# EAGLE design photoresistor-array (EAGLE 8.3.1)
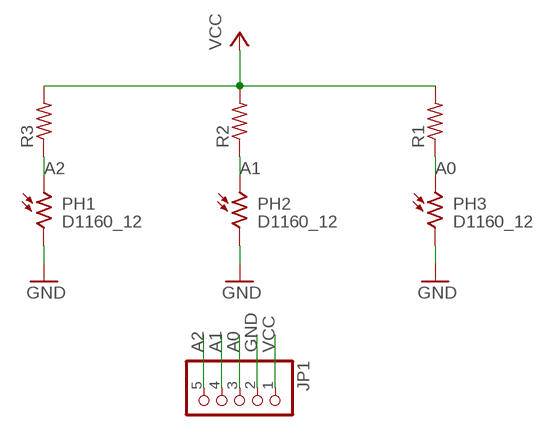
[diagram p0: schematic, sheet 1]

## Parts
JP1  PINHD-1X5  [1X05]
PH1  D1160_12  [D11XX]
PH2  D1160_12  [D11XX]
PH3  D1160_12  [D11XX]
R1  R-US_0207/10  [0207/10]
R2  R-US_0207/10  [0207/10]
R3  R-US_0207/10  [0207/10]

## Nets
A0: JP1.3 PH3.1 R1.1
A1: JP1.4 PH2.1 R2.1
A2: JP1.5 PH1.1 R3.1
GND: JP1.2 PH1.2 PH2.2 PH3.2
VCC: JP1.1 R1.2 R2.2 R3.2

## Library data of the parts
JP1 = pinhead:PINHD-1X5: PIN HEADER
PH1-PH3 = photo-elements:D11: Photo Sensor Oil Burner Control Applications Source: http://optoelectronics.perkinelmer.com/content/Datasheets/DTS_PhotocellsD1160.pdf
R1-R3 = resistor:R-US_: RESISTOR, American symbol

## Board
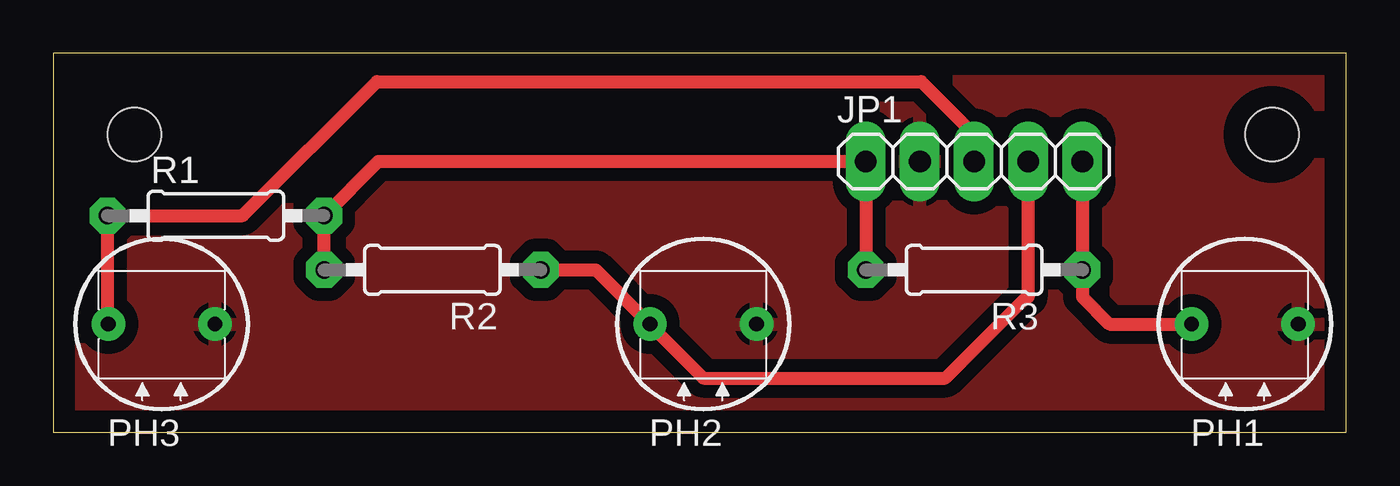
[diagram p1: board, top side]

Size 60.63 x 17.77 mm. Coordinates in mm from the lower left corner, seen from the top.
Outline: 0,0 60.63,0 60.63,17.77 0,17.77 0,0
Copper layers (1*16): Top 0.035mm / dielectric 1.5mm / Bottom 0.035mm
Design rules "default *": minimum track width 24mil, minimum drill 0.35mm, track to track 24mil, track to pad 24mil, pad to pad 24mil, via to via 24mil, smd to smd 24mil, copper to edge 40mil, drill to drill 24mil, minimum pad ring 17mil, minimum via ring 8mil, stop-mask expansion 4mil, vias tented up to drill 0mil, thermal gap 10mil
Holes 2.5 mm at 3.81,13.97 57.15,13.97

### Footprints (pad centres in the part's own frame; a part is rotated, then mirrored left to right if it is on the bottom)
1X05 = drill 1.016 long: 1 -5.08,0; 2 -2.54,0; 3 0,0; 4 2.54,0; 5 5.08,0
D11XX = drill 0.7 pad 1.4: 1 -2.5,0; 2 2.5,0
0207/10 = drill 0.813 octagon: 1 -5.08,0; 2 5.08,0

### Placement (x,y rotation side)
JP1  43.18,12.7 0 top
PH1  55.88,5.08 0 top
PH2  30.48,5.08 0 top
PH3  5.08,5.08 0 top
R1  7.62,10.16 0 top
R2  17.78,7.62 180 top
R3  43.18,7.62 180 top

### Tracks (layer width: path | path; a pad name or v marks a point on that pad's centre or on a via)
A0
  Top 0.61: PH3.1 2.54,5.12 R1.1 8.89,10.16 15.18,16.45 40.7,16.45 43.18,13.97 JP1.3
A1
  Top 0.61: 45.72,6.43 JP1.4 | 45.72,6.43 45.72,6.35 | R2.1 25.44,7.62 PH2.1 27.98,5.04 30.48,2.54 41.83,2.54 45.72,6.43
A2
  Top 0.61: JP1.5 R3.1 48.26,6.35 49.53,5.08 PH1.1
GND
  Top 0.61: PH2.2 33.02,5.08 | PH1.2 58.38,5.04
  pour Top: 0,17.78 0,0 60.96,0 60.96,17.78
VCC
  Top 0.61: R2.2 R1.2 15.24,12.7 JP1.1 R3.2